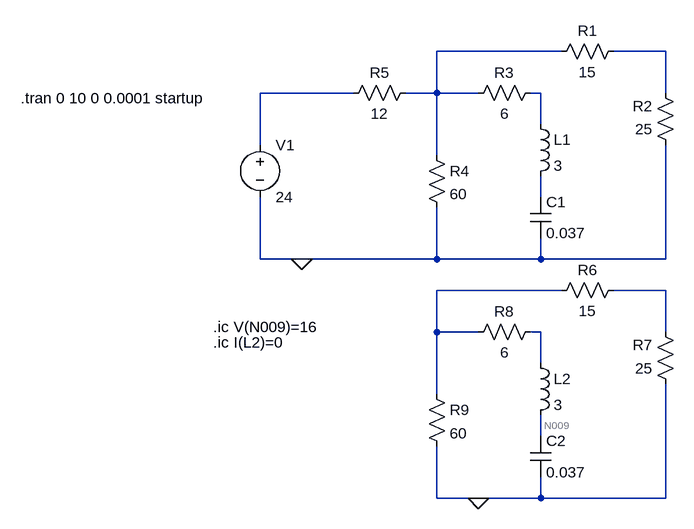
[diagram p0: schematic Q16_25.asc]
Q16_25.asc, the LTspice schematic file:
Version 4
SHEET 1 880 788
WIRE 160 80 -32 80
WIRE 320 80 240 80
WIRE -160 144 -304 144
WIRE -32 144 -32 80
WIRE -32 144 -80 144
WIRE 32 144 -32 144
WIRE 128 144 112 144
WIRE 320 144 320 80
WIRE 128 192 128 144
WIRE -304 224 -304 144
WIRE -32 240 -32 144
WIRE 128 304 128 272
WIRE -304 400 -304 304
WIRE -240 400 -304 400
WIRE -32 400 -32 320
WIRE -32 400 -240 400
WIRE 128 400 128 368
WIRE 128 400 -32 400
WIRE 320 400 320 224
WIRE 320 400 128 400
WIRE 160 448 -32 448
WIRE 320 448 240 448
WIRE -32 512 -32 448
WIRE 32 512 -32 512
WIRE 128 512 112 512
WIRE 320 512 320 448
WIRE 128 560 128 512
WIRE -32 608 -32 512
WIRE 128 672 128 640
WIRE -32 768 -32 688
WIRE 32 768 -32 768
WIRE 128 768 128 736
WIRE 128 768 32 768
WIRE 320 768 320 592
WIRE 320 768 128 768
FLAG -240 400 0
FLAG 32 768 0
SYMBOL res 256 64 R90
WINDOW 0 0 56 VBottom 2
WINDOW 3 32 56 VTop 2
SYMATTR InstName R1
SYMATTR Value 15
SYMBOL res 336 240 R180
WINDOW 0 36 76 Left 2
WINDOW 3 36 40 Left 2
SYMATTR InstName R2
SYMATTR Value 25
SYMBOL res 16 160 R270
WINDOW 0 32 56 VTop 2
WINDOW 3 0 56 VBottom 2
SYMATTR InstName R3
SYMATTR Value 6
SYMBOL ind 112 176 R0
SYMATTR InstName L1
SYMATTR Value 3
SYMBOL cap 112 304 R0
SYMATTR InstName C1
SYMATTR Value 0.037
SYMBOL res -48 224 R0
SYMATTR InstName R4
SYMATTR Value 60
SYMBOL res -64 128 R90
WINDOW 0 0 56 VBottom 2
WINDOW 3 32 56 VTop 2
SYMATTR InstName R5
SYMATTR Value 12
SYMBOL voltage -304 208 R0
WINDOW 123 0 0 Left 0
WINDOW 39 0 0 Left 0
SYMATTR InstName V1
SYMATTR Value 24
SYMBOL res 256 432 R90
WINDOW 0 0 56 VBottom 2
WINDOW 3 32 56 VTop 2
SYMATTR InstName R6
SYMATTR Value 15
SYMBOL res 336 608 R180
WINDOW 0 36 76 Left 2
WINDOW 3 36 40 Left 2
SYMATTR InstName R7
SYMATTR Value 25
SYMBOL res 16 528 R270
WINDOW 0 32 56 VTop 2
WINDOW 3 0 56 VBottom 2
SYMATTR InstName R8
SYMATTR Value 6
SYMBOL ind 112 544 R0
SYMATTR InstName L2
SYMATTR Value 3
SYMBOL cap 112 672 R0
SYMATTR InstName C2
SYMATTR Value 0.037
SYMBOL res -48 592 R0
SYMATTR InstName R9
SYMATTR Value 60
TEXT -672 152 Left 2 !.tran 0 10 0 0.0001 startup
TEXT -376 504 Left 2 !.ic V(N009)=16
TEXT -376 528 Left 2 !.ic I(L2)=0

The netlist it stands for:
* Q16_25.asc
R1 N002 N001 15
R2 0 N002 25
R3 N001 N004 6
L1 N004 N005 3
C1 N005 0 0.037
R4 N001 0 60
R5 N001 N003 12
V1 N003 0 24
R6 N007 N006 15
R7 0 N007 25
R8 N006 N008 6
L2 N008 N009 3
C2 N009 0 0.037
R9 N006 0 60
.tran 0 10 0 0.0001 startup
.ic V(N009)=16
.ic I(L2)=0
.backanno
.end